# EAGLE design LCD_i2c_Encoder (EAGLE 9.4.2)
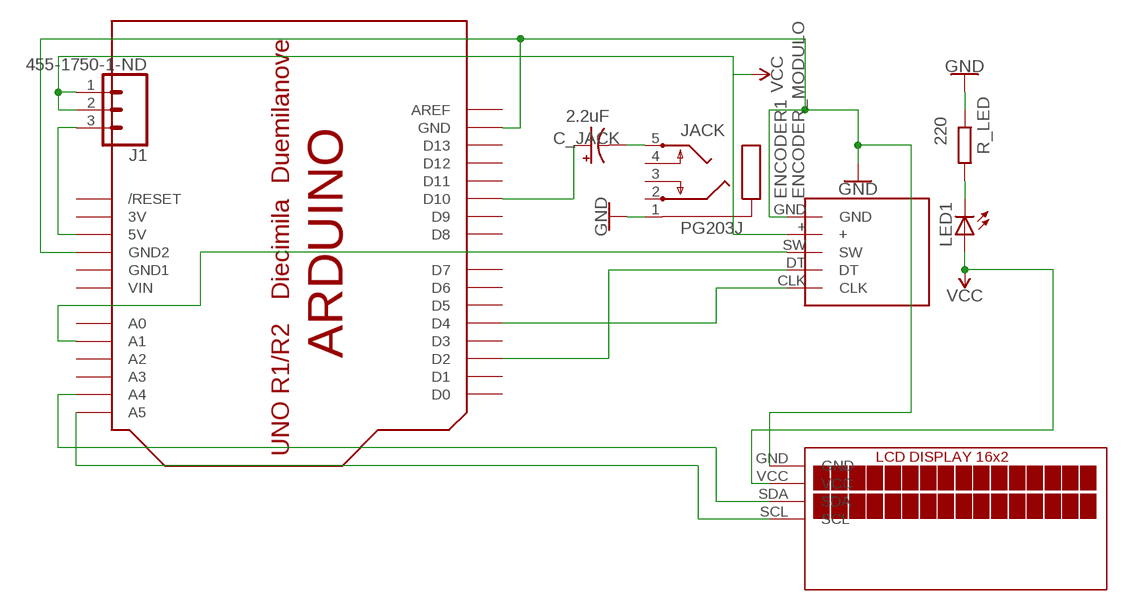
[diagram p0: schematic, sheet 1]

## Parts
C_JACK  CPOL-USE2,5-6E  [E2,5-6E]
ENCODER1  ENCODER_MODULO  [ENCODER_MODULO]
J1  455-1750-1-ND  CONN_03  [1X03]
JACK  PG203J  [PG203J]
LCD1  LCDI2C  [TUXGR_16X2_R2]
LED1  LED5MM  [LED5MM]
R_LED  R-EU_0204/7  [0204/7]
U$1  ARDUINOUNO  [ARDUINO]

## Nets
GND: ENCODER1.GND JACK.1 LCD1.GND R_LED.2 U$1.GND U$1.GND2
N$1: C_JACK.+ U$1.D10
N$3: ENCODER1.SW U$1.A1
N$4: LED1.K(C) R_LED.1
N$5: J1.3 U$1.5V
N$7: C_JACK.- JACK.5
N$8: LCD1.SDA U$1.A4
N$9: LCD1.SCL U$1.A5
N$17: ENCODER1.CLK U$1.D4
N$18: ENCODER1.DT U$1.D2
VCC: ENCODER1.+ J1.1 J1.2 LCD1.VCC LED1.A
Unconnected: JACK.2 JACK.3 JACK.4 U$1.A0 U$1.A2 U$1.A3 U$1.AREF U$1.D0 U$1.D1 U$1.D3 U$1.D5 U$1.D6 U$1.D7 U$1.D8 U$1.D9 U$1.D11 U$1.D12 U$1.D13 U$1.RESET(/RESET)

## Power pins joined to a net without a drawn wire
3V: U$1.3V
GND1: U$1.GND1
VIN: U$1.VIN

## Library data of the parts
C_JACK = adafruit:CPOL-US: POLARIZED CAPACITOR, American symbol; CAPACITANCIA: 2.2uF
ENCODER1 = ENCODER:ENCODER_MODULO
J1 = SparkFun-Connectors:CONN_03: Multi connection point. Often used as Generic Header-pin footprint for 0.1 inch spaced/style header connections On any of the 0.1 inch spaced packages, you can populate with these: Break Away Headers - Straight <https://www.sparkfun.com/products/116> (PRT-00116) Break Away Male Headers - Right Angle <https://www.sparkfun.com/products/553> (PRT-00553) Female Headers <https://www.sparkfun.com/products/115> (PRT-00115) Break Away Headers - Machine Pin <https://www.sparkfun.com/products/117> (PRT-00117) Break Away Female Headers - Swiss Machine Pin <https://www.sparkfun.com/products/743> (PRT-00743) Stackable Header - 3 Pin (Female, 0.1") <https://www.sparkfun.com/products/13875> (PRT-13875) For SCREWTERMINALS and SPRING TERMINALS visit here: Screw Terimnals on SparkFun.com <https://www.sparkfun.com/search/results?term=Screw+Terminals> (5mm/3.5mm/2.54mm spacing) This device is also useful as a general connection point to wire up your design to another part of your project. Our various solder wires solder well into these plated through hole pads. Hook-Up Wire - Assortment (Stranded, 22 AWG) <https://www.sparkfun.com/products/11375> (PRT-11375) Hook-Up Wire - Assortment (Solid Core, 22 AWG) <https://www.sparkfun.com/products/11367> (PRT-11367) View the entire wire category on our website here <https://www.sparkfun.com/categories/141> Special notes: Molex polarized connector foot print use with SKU : PRT-08232 with associated crimp pins and housings.; PROD_ID: XXX-00000
JACK = con-hirschmann:PG203J: MIC/HEADPHONE JACK KS-S stereo microphone/headphone jack PG203JN (Schukat); OC_FARNELL: unknown; OC_NEWARK: unknown
LCD1 = LCD_12c:LCDI2C
LED1 = adafruit:LED: LED OSRAM: - CHIPLED LG R971, LG N971, LY N971, LG Q971, LY Q971, LO R971, LY R971 LH N974, LH R974 LS Q976, LO Q976, LY Q976 LO Q996 - Hyper CHIPLED LW Q18S LB Q993, LB Q99A, LB R99A - SideLED LS A670, LO A670, LY A670, LG A670, LP A670 LB A673, LV A673, LT A673, LW A673 LH A674 LY A675 LS A676, LA A676, LO A676, LY A676, LW A676 LS A679, LY A679, LG A679 - Hyper Micro SIDELED® LS Y876, LA Y876, LO Y876, LY Y876 LT Y87S - SmartLED LW L88C, LW L88S LB L89C, LB L89S, LG L890 LS L89K, LO L89K, LY L89K LS L896, LA L896, LO L896, LY L896 - TOPLED LS T670, LO T670, LY T670, LG T670, LP T670 LSG T670, LSP T670, LSY T670, LOP T670, LYG T670 LG T671, LOG T671, LSG T671 LB T673, LV T673, LT T673, LW T673 LH T674 LS T676, LA T676, LO T676, LY T676, LB T676, LH T676, LSB T676, LW T676 LB T67C, LV T67C, LT T67C, LS T67K, LO T67K, LY T67K, LW E67C LS E67B, LA E67B, LO E67B, LY E67B, LB E67C, LV E67C, LT E67C LW T67C LS T679, LY T679, LG T679 LS T770, LO T770, LY T770, LG T770, LP T770 LB T773, LV T773, LT T773, LW T773 LH T774 LS E675, LA E675, LY E675, LS T675 LS T776, LA T776, LO T776, LY T776, LB T776 LHGB T686 LT T68C, LB T68C - Hyper Mini TOPLED® LB M676 - Mini TOPLED Santana® LG M470 LS M47K, LO M47K, LY M47K Source: http://www.osram.convergy.de/
R_LED = rcl:R-EU_: RESISTOR, European symbol; RESISTENCIA: 220; SPICEPREFIX: R
U$1 = Arduino_Espejo:ARDUINO: Arduino Diecimila/Duemilanove Make a shield with ease, this package has all the named pins as well as the two mounting drill holes and an outline of the USB and DC power connector. The outline is on the DIMENSION layer, so if your board house uses it they will cut the outline to match. http://www.ladyada.net/library/pcb/eaglelibrary.html

## Net classes
0 default: width 0.305 mm, drill 0.305 mm, clearance 0.305 mm

## Board
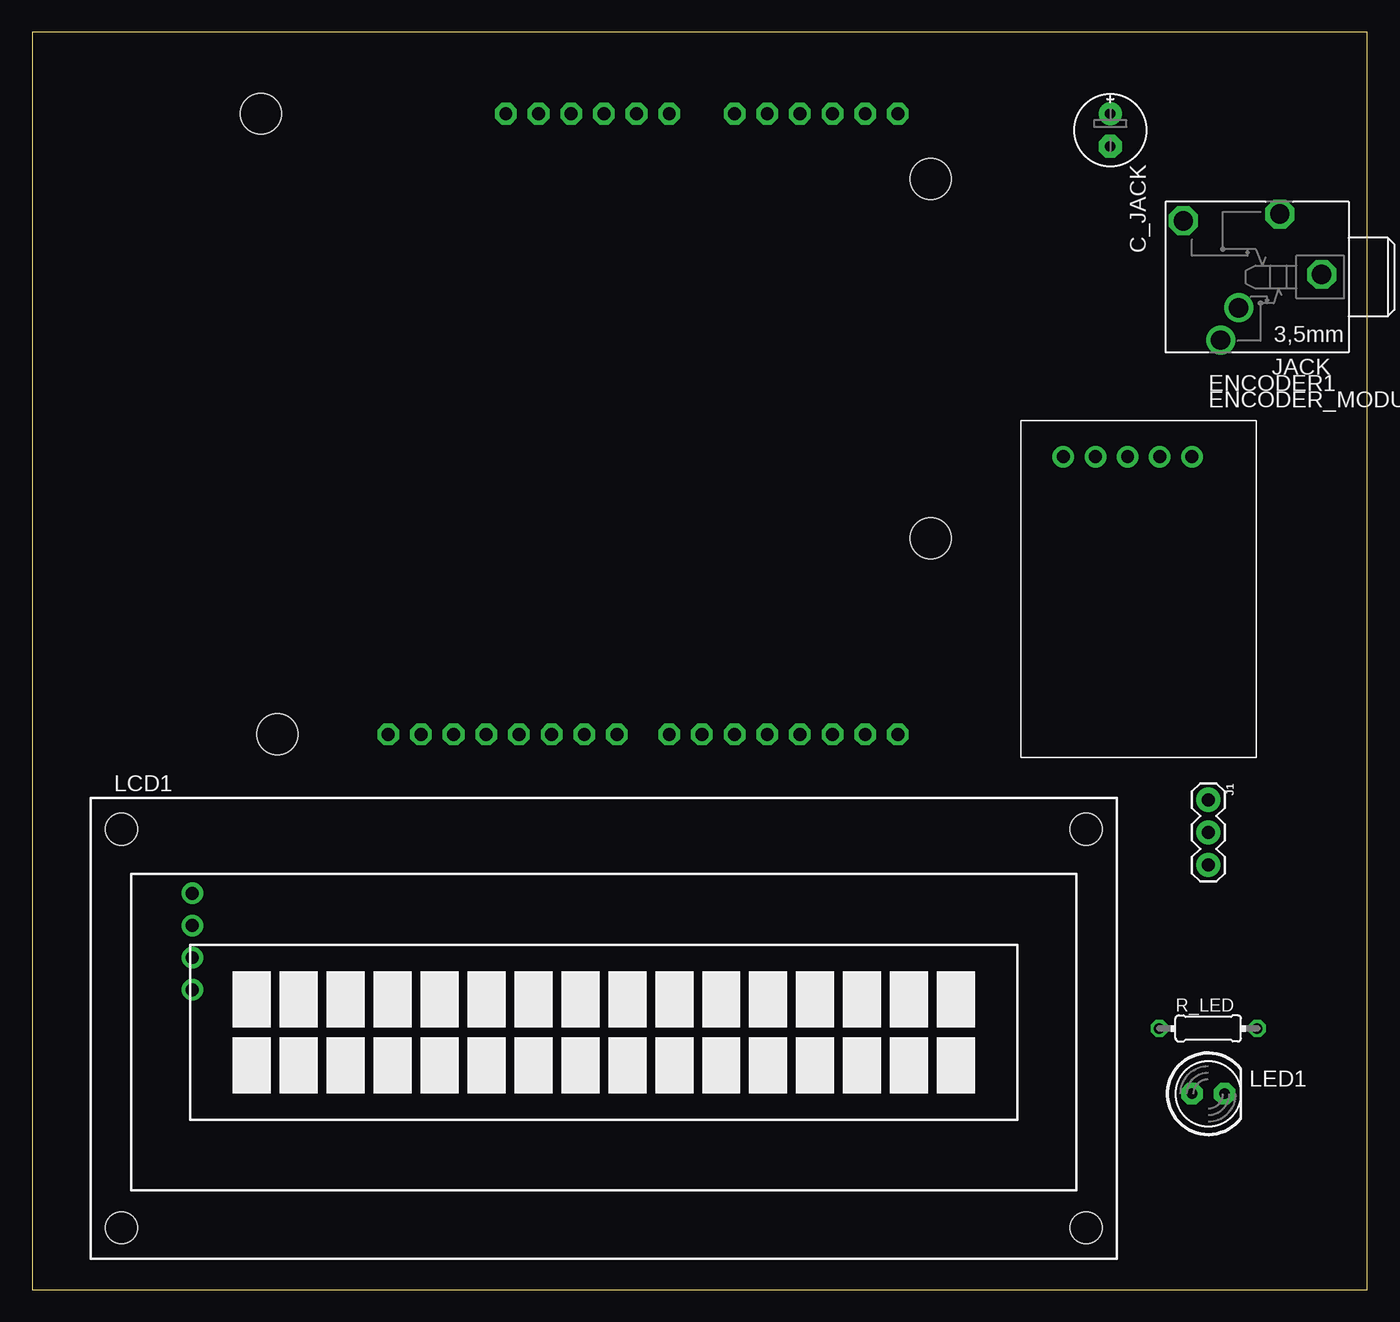
[diagram p1: board, top side]
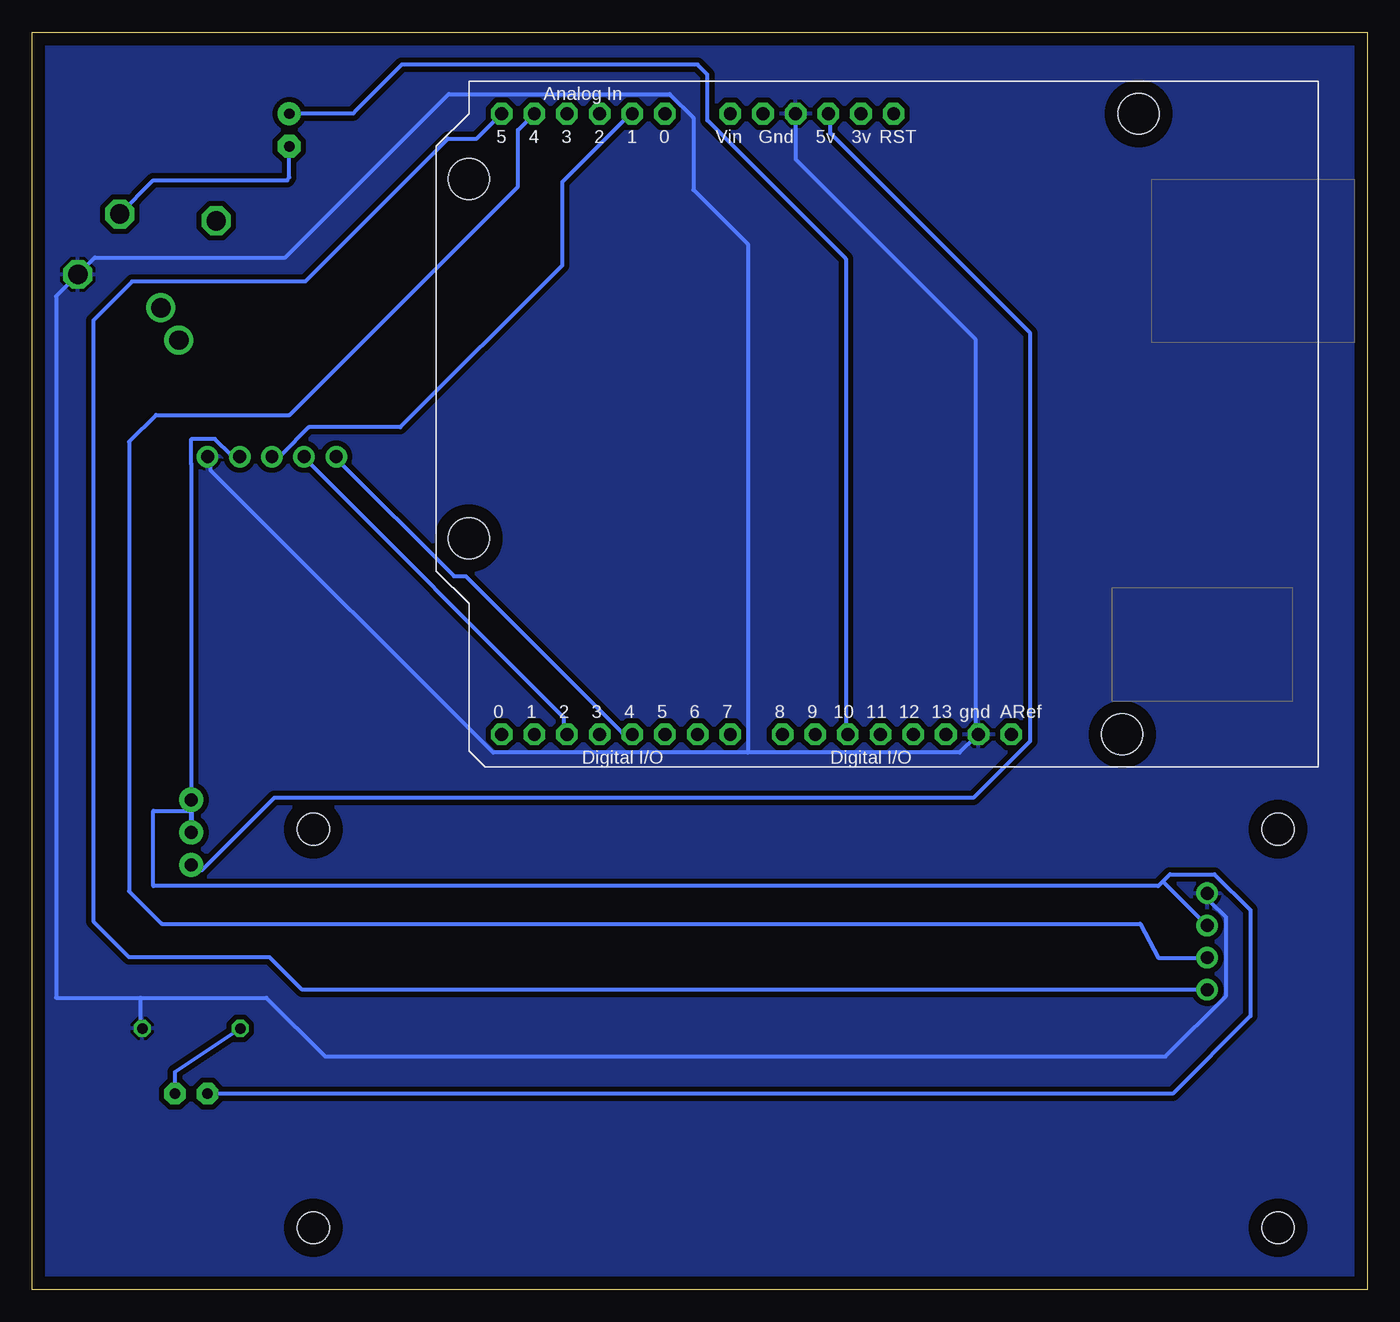
[diagram p2: board, bottom side, seen from below]

Size 103.81 x 97.78 mm. Coordinates in mm from the lower left corner, seen from the top.
Outline: 0,0 103.81,0 103.81,97.78 0,97.78 0,0
Copper layers (1*16): Top 0.035mm / dielectric 1.5mm / Bottom 0.035mm
Design rules "default *": minimum track width 12mil, minimum drill 0.35mm, track to track 12mil, track to pad 12mil, pad to pad 12mil, via to via 12mil, smd to smd 6mil, copper to edge 40mil, drill to drill 6mil, minimum pad ring 10mil, minimum via ring 8mil, stop-mask expansion 4mil, vias tented up to drill 0mil, thermal gap 10mil

### Footprints (pad centres in the part's own frame; a part is rotated, then mirrored left to right if it is on the bottom)
E2,5-6E = drill 0.813 pad 1.778: + -1.27,0 | drill 0.813 pad 1.778 octagon: - 1.27,0
ENCODER_MODULO = drill 1 pad 1.676: + -2.5,0; CLK -10,0; DT -7.5,0; GND 0,0; SW -5,0
1X03 = drill 1.016 pad 1.88: 1 0,0; 2 2.54,0; 3 5.08,0
PG203J = drill 1.499 octagon: 1 -5.004,-0.203; 4 5.74,-4.369; 5 -1.753,-4.902 | drill 1.499: 2 2.845,4.902; 3 1.448,2.388
TUXGR_16X2_R2 = drill 1 pad 1.676: GND -32,10.5; SCL -32,3; SDA -32,5.5; VCC -32,8 | hole 2.5: -37.5,-15.5; 37.5,-15.5; -37.5,15.5; 37.5,15.5
LED5MM = drill 0.813 pad 1.676 octagon: A -1.27,0; K 1.27,0
0204/7 = drill 0.813 octagon: 1 -3.81,0; 2 3.81,0
ARDUINO = drill 1 pad 1.676 octagon: 3V 31.75,49.53; 5V 34.29,49.53; A0 46.99,49.53; A1 49.53,49.53; A2 52.07,49.53; A3 54.61,49.53; A4 57.15,49.53; A5 59.69,49.53; AREF 20.066,1.27; D0 59.69,1.27; D1 57.15,1.27; D2 54.61,1.27; D3 52.07,1.27; D4 49.53,1.27; D5 46.99,1.27; D6 44.45,1.27; D7 41.91,1.27; D8 37.846,1.27; D9 35.306,1.27; D10 32.766,1.27; D11 30.226,1.27; D12 27.686,1.27; D13 25.146,1.27; GND 22.606,1.27; GND1 39.37,49.53; GND2 36.83,49.53; RESET 29.21,49.53; VIN 41.91,49.53 | hole 3.2: 11.43,1.27; 62.23,16.51; 10.16,49.53; 62.23,44.45

### Placement (x,y rotation side)
C_JACK  83.82,90.17 270 top
ENCODER1  90.17,64.77 0 top
J1  91.44,38.1 270 top
JACK  95.25,78.74 180 top
LCD1  44.45,20.32 0 top
LED1  91.44,15.24 0 top
R_LED  91.44,20.32 0 top
U$1  7.62,41.91 0 top

### Tracks (layer width: path | path; a pad name or v marks a point on that pad's centre or on a via)
GND
  Bottom 0.305: U$1.GND2 44.45,87.88 30.48,73.91 30.48,43.28 U$1.GND 30.48,42.98 31.7,41.76 48.16,41.76 | 48.16,41.76 67.97,41.76 89.92,63.7 89.92,64.62 ENCODER1.GND | 95.4,22.71 95.4,20.52 R_LED.2 | 95.4,22.71 101.96,22.71 101.96,77.24 JACK.1 98.93,80.26 84.12,80.26 71.42,92.96 54.25,92.96 52.4,91.11 52.4,85.52 48.16,81.28 48.16,41.76 | 95.4,22.71 85.6,22.71 81.03,18.14 15.7,18.14 10.97,22.86 10.97,28.96 12.19,30.18 12.19,30.79 LCD1.GND
  pour Bottom (isolate 0.406): 0,0 0,97.79 104.14,97.79 104.14,0
N$1
  Bottom 0.305: U$1.D10 40.54,43.28 40.54,80.16 51.31,90.93 51.31,94.49 52.07,95.25 75.08,95.25 78.69,91.64 78.84,91.44 C_JACK.+
N$3
  Bottom 0.305: ENCODER1.SW 85.04,64.92 84.43,64.92 82.3,67.06 75.18,67.06 62.61,79.63 62.61,86.13 57.3,91.44 U$1.A1
N$4
  Bottom 0.305: R_LED.1 92.71,16.93 LED1.K
N$5
  Bottom 0.305: J1.3 91.03,32.61 90.63,32.61 84.99,38.25 30.63,38.25 26.21,42.67 26.21,74.37 41.76,89.92 41.76,91.44 U$1.5V
N$7
  Bottom 0.305: JACK.5 94.39,86.26 83.97,86.26 83.82,86.47 C_JACK.-
N$8
  Bottom 0.305: U$1.A4 66.04,90.17 66.04,85.78 83.8,68.02 94.18,68.02 96.27,65.94 96.27,30.99 93.73,28.45 17.66,28.45 16.26,25.82 LCD1.SDA
N$9
  Bottom 0.305: LCD1.SCL 82.81,23.32 85.34,25.86 96.27,25.86 99.06,28.64 99.06,75.36 96.04,78.38 82.6,78.38 71.48,89.5 69.25,89.5 U$1.A5
N$17
  Bottom 0.305: U$1.D4 57.3,43.28 57.91,43.28 70.1,55.47 71.02,55.47 80.16,64.62 ENCODER1.CLK
N$18
  Bottom 0.305: U$1.D2 62.48,43.28 62.48,44.5 82.6,64.62 ENCODER1.DT
VCC
  Bottom 0.305: ENCODER1.+ 87.78,64.92 88.39,64.92 89.61,66.14 91.39,66.14 91.47,66.06 91.47,64.23 91.44,64.21 91.44,37.24 | 91.44,38.25 J1.1 J1.2 91.44,38.19 91.39,38.25 91.39,35.97 91.44,35.97 91.44,37.24 | LED1.A 15.14,15.24 9.09,21.29 9.09,29.52 11.89,32.31 15.34,32.31 15.9,31.75 | 15.9,31.75 16.26,31.39 94.39,31.39 94.39,37.24 91.44,37.24 | 15.9,31.75 12.5,28.35 LCD1.VCC